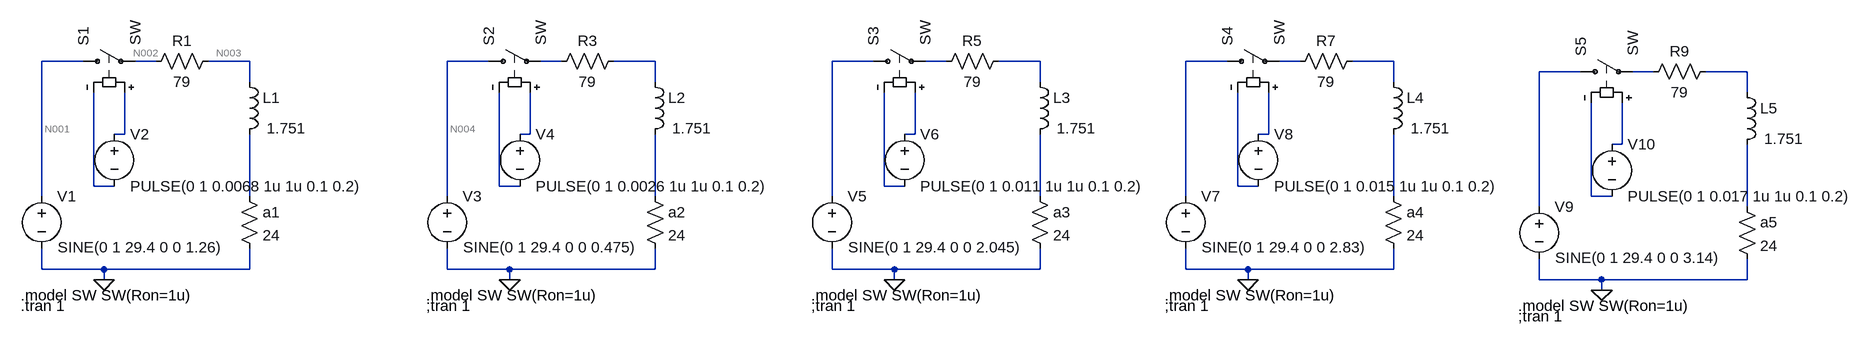
[diagram p0: schematic part3.asc]
part3.asc, the LTspice schematic file:
Version 4
SHEET 1 2548 680
WIRE -208 -384 -272 -384
WIRE -96 -384 -128 -384
WIRE 48 -384 -16 -384
WIRE 416 -384 352 -384
WIRE 528 -384 496 -384
WIRE 672 -384 608 -384
WIRE 1008 -384 944 -384
WIRE 1120 -384 1088 -384
WIRE 1264 -384 1200 -384
WIRE 1552 -384 1488 -384
WIRE 1664 -384 1632 -384
WIRE 1808 -384 1744 -384
WIRE 2096 -368 2032 -368
WIRE 2208 -368 2176 -368
WIRE 2352 -368 2288 -368
WIRE 48 -352 48 -384
WIRE 672 -352 672 -384
WIRE 1264 -352 1264 -384
WIRE 1808 -352 1808 -384
WIRE 2352 -336 2352 -368
WIRE -144 -272 -144 -336
WIRE -144 -272 -160 -272
WIRE 480 -272 480 -336
WIRE 480 -272 464 -272
WIRE 1072 -272 1072 -336
WIRE 1072 -272 1056 -272
WIRE 1616 -272 1616 -336
WIRE 1616 -272 1600 -272
WIRE 2160 -256 2160 -320
WIRE 2160 -256 2144 -256
WIRE -192 -192 -192 -336
WIRE -160 -192 -192 -192
WIRE 432 -192 432 -336
WIRE 464 -192 432 -192
WIRE 1024 -192 1024 -336
WIRE 1056 -192 1024 -192
WIRE 1568 -192 1568 -336
WIRE 1600 -192 1568 -192
WIRE -272 -176 -272 -384
WIRE 48 -176 48 -272
WIRE 352 -176 352 -384
WIRE 672 -176 672 -272
WIRE 944 -176 944 -384
WIRE 1264 -176 1264 -272
WIRE 1488 -176 1488 -384
WIRE 1808 -176 1808 -272
WIRE 2112 -176 2112 -320
WIRE 2144 -176 2112 -176
WIRE 2032 -160 2032 -368
WIRE 2352 -160 2352 -256
WIRE -272 -64 -272 -96
WIRE -176 -64 -272 -64
WIRE 48 -64 48 -96
WIRE 48 -64 -176 -64
WIRE 352 -64 352 -96
WIRE 448 -64 352 -64
WIRE 672 -64 672 -96
WIRE 672 -64 448 -64
WIRE 944 -64 944 -96
WIRE 1040 -64 944 -64
WIRE 1264 -64 1264 -96
WIRE 1264 -64 1040 -64
WIRE 1488 -64 1488 -96
WIRE 1584 -64 1488 -64
WIRE 1808 -64 1808 -96
WIRE 1808 -64 1584 -64
WIRE -176 -48 -176 -64
WIRE 448 -48 448 -64
WIRE 1040 -48 1040 -64
WIRE 1584 -48 1584 -64
WIRE 2032 -48 2032 -80
WIRE 2128 -48 2032 -48
WIRE 2352 -48 2352 -80
WIRE 2352 -48 2128 -48
WIRE 2128 -32 2128 -48
FLAG -176 -48 0
FLAG 448 -48 0
FLAG 1040 -48 0
FLAG 1584 -48 0
FLAG 2128 -32 0
SYMBOL res -112 -368 R270
WINDOW 0 32 56 VTop 2
WINDOW 3 0 56 VBottom 2
SYMATTR InstName R1
SYMATTR Value 79
SYMBOL voltage -272 -192 R0
WINDOW 3 25 94 Left 2
WINDOW 123 0 0 Left 0
WINDOW 39 0 0 Left 0
SYMATTR Value SINE(0 1 29.4 0 0 1.26)
SYMATTR InstName V1
SYMBOL ind 32 -368 R0
WINDOW 3 42 87 Left 2
SYMATTR Value 1.751
SYMATTR InstName L1
SYMBOL sw -224 -384 R270
SYMATTR InstName S1
SYMBOL res 32 -192 R0
SYMATTR InstName a1
SYMATTR Value 24
SYMBOL voltage -160 -288 R0
WINDOW 123 0 0 Left 0
WINDOW 39 0 0 Left 0
SYMATTR InstName V2
SYMATTR Value PULSE(0 1 0.0068 1u 1u 0.1 0.2)
SYMBOL res 512 -368 R270
WINDOW 0 32 56 VTop 2
WINDOW 3 0 56 VBottom 2
SYMATTR InstName R3
SYMATTR Value 79
SYMBOL voltage 352 -192 R0
WINDOW 3 25 94 Left 2
WINDOW 123 0 0 Left 0
WINDOW 39 0 0 Left 0
SYMATTR Value SINE(0 1 29.4 0 0 0.475)
SYMATTR InstName V3
SYMBOL ind 656 -368 R0
WINDOW 3 42 87 Left 2
SYMATTR Value 1.751
SYMATTR InstName L2
SYMBOL sw 400 -384 R270
SYMATTR InstName S2
SYMBOL res 656 -192 R0
SYMATTR InstName a2
SYMATTR Value 24
SYMBOL voltage 464 -288 R0
WINDOW 123 0 0 Left 0
WINDOW 39 0 0 Left 0
SYMATTR InstName V4
SYMATTR Value PULSE(0 1 0.0026 1u 1u 0.1 0.2)
SYMBOL res 1104 -368 R270
WINDOW 0 32 56 VTop 2
WINDOW 3 0 56 VBottom 2
SYMATTR InstName R5
SYMATTR Value 79
SYMBOL voltage 944 -192 R0
WINDOW 3 25 94 Left 2
WINDOW 123 0 0 Left 0
WINDOW 39 0 0 Left 0
SYMATTR Value SINE(0 1 29.4 0 0 2.045)
SYMATTR InstName V5
SYMBOL ind 1248 -368 R0
WINDOW 3 42 87 Left 2
SYMATTR Value 1.751
SYMATTR InstName L3
SYMBOL sw 992 -384 R270
SYMATTR InstName S3
SYMBOL res 1248 -192 R0
SYMATTR InstName a3
SYMATTR Value 24
SYMBOL voltage 1056 -288 R0
WINDOW 123 0 0 Left 0
WINDOW 39 0 0 Left 0
SYMATTR InstName V6
SYMATTR Value PULSE(0 1 0.011 1u 1u 0.1 0.2)
SYMBOL res 1648 -368 R270
WINDOW 0 32 56 VTop 2
WINDOW 3 0 56 VBottom 2
SYMATTR InstName R7
SYMATTR Value 79
SYMBOL voltage 1488 -192 R0
WINDOW 3 25 94 Left 2
WINDOW 123 0 0 Left 0
WINDOW 39 0 0 Left 0
SYMATTR Value SINE(0 1 29.4 0 0 2.83)
SYMATTR InstName V7
SYMBOL ind 1792 -368 R0
WINDOW 3 42 87 Left 2
SYMATTR Value 1.751
SYMATTR InstName L4
SYMBOL sw 1536 -384 R270
SYMATTR InstName S4
SYMBOL res 1792 -192 R0
SYMATTR InstName a4
SYMATTR Value 24
SYMBOL voltage 1600 -288 R0
WINDOW 123 0 0 Left 0
WINDOW 39 0 0 Left 0
SYMATTR InstName V8
SYMATTR Value PULSE(0 1 0.015 1u 1u 0.1 0.2)
SYMBOL res 2192 -352 R270
WINDOW 0 32 56 VTop 2
WINDOW 3 0 56 VBottom 2
SYMATTR InstName R9
SYMATTR Value 79
SYMBOL voltage 2032 -176 R0
WINDOW 3 25 94 Left 2
WINDOW 123 0 0 Left 0
WINDOW 39 0 0 Left 0
SYMATTR Value SINE(0 1 29.4 0 0 3.14)
SYMATTR InstName V9
SYMBOL ind 2336 -352 R0
WINDOW 3 42 87 Left 2
SYMATTR Value 1.751
SYMATTR InstName L5
SYMBOL sw 2080 -368 R270
SYMATTR InstName S5
SYMBOL res 2336 -176 R0
SYMATTR InstName a5
SYMATTR Value 24
SYMBOL voltage 2144 -272 R0
WINDOW 123 0 0 Left 0
WINDOW 39 0 0 Left 0
SYMATTR InstName V10
SYMATTR Value PULSE(0 1 0.017 1u 1u 0.1 0.2)
TEXT -304 -24 Left 2 !.model SW SW(Ron=1u)
TEXT -304 -8 Left 2 !.tran 1
TEXT 320 -24 Left 2 !.model SW SW(Ron=1u)
TEXT 320 -8 Left 2 !;tran 1
TEXT 912 -24 Left 2 !.model SW SW(Ron=1u)
TEXT 912 -8 Left 2 !;tran 1
TEXT 1456 -24 Left 2 !.model SW SW(Ron=1u)
TEXT 1456 -8 Left 2 !;tran 1
TEXT 2000 -8 Left 2 !.model SW SW(Ron=1u)
TEXT 2000 8 Left 2 !;tran 1

The netlist it stands for:
* part3.asc
R1 N002 N003 79
V1 N001 0 SINE(0 1 29.4 0 0 1.26)
L1 N003 N025 1.751
S1 N001 N002 N016 N021 SW
R§a1 N025 0 24
V2 N016 N021 PULSE(0 1 0.0068 1u 1u 0.1 0.2)
R3 N005 N006 79
V3 N004 0 SINE(0 1 29.4 0 0 0.475)
L2 N006 N026 1.751
S2 N004 N005 N017 N022 SW
R§a2 N026 0 24
V4 N017 N022 PULSE(0 1 0.0026 1u 1u 0.1 0.2)
R5 N008 N009 79
V5 N007 0 SINE(0 1 29.4 0 0 2.045)
L3 N009 N027 1.751
S3 N007 N008 N018 N023 SW
R§a3 N027 0 24
V6 N018 N023 PULSE(0 1 0.011 1u 1u 0.1 0.2)
R7 N011 N012 79
V7 N010 0 SINE(0 1 29.4 0 0 2.83)
L4 N012 N028 1.751
S4 N010 N011 N019 N024 SW
R§a4 N028 0 24
V8 N019 N024 PULSE(0 1 0.015 1u 1u 0.1 0.2)
R9 N014 N015 79
V9 N013 0 SINE(0 1 29.4 0 0 3.14)
L5 N015 N030 1.751
S5 N013 N014 N020 N029 SW
R§a5 N030 0 24
V10 N020 N029 PULSE(0 1 0.017 1u 1u 0.1 0.2)
.model SW SW(Ron=1u)
.tran 1
.model SW SW(Ron=1u)
;tran 1
.model SW SW(Ron=1u)
;tran 1
.model SW SW(Ron=1u)
;tran 1
.model SW SW(Ron=1u)
;tran 1
.backanno
.end

* Results of the author's LTspice run, read from the files saved beside the schematic
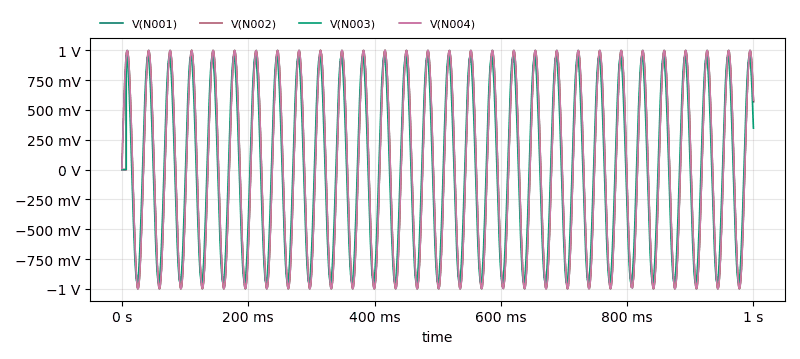
[diagram p1: Transient Analysis of part3.asc, plotted from the saved traces]
* Transient Analysis, 1 run:
*   V(N001): min -999.9 mV, max 999.9 mV, average 9.862 mV, rms 708.3 mV, last 569.9 mV
*   V(N002): min -997.8 mV, max 999.9 mV, average 6.012 mV, rms 702.2 mV, last 569.9 mV
*   V(N003): min -955.6 mV, max 958.5 mV, average 5.225 mV, rms 670.4 mV, last 347.9 mV
*   V(N004): min -999.6 mV, max 1 V, average 9.82 mV, rms 708.2 mV, last 581.1 mV